# EAGLE design Relaya_the second Version 2 (EAGLE 9.1.2)
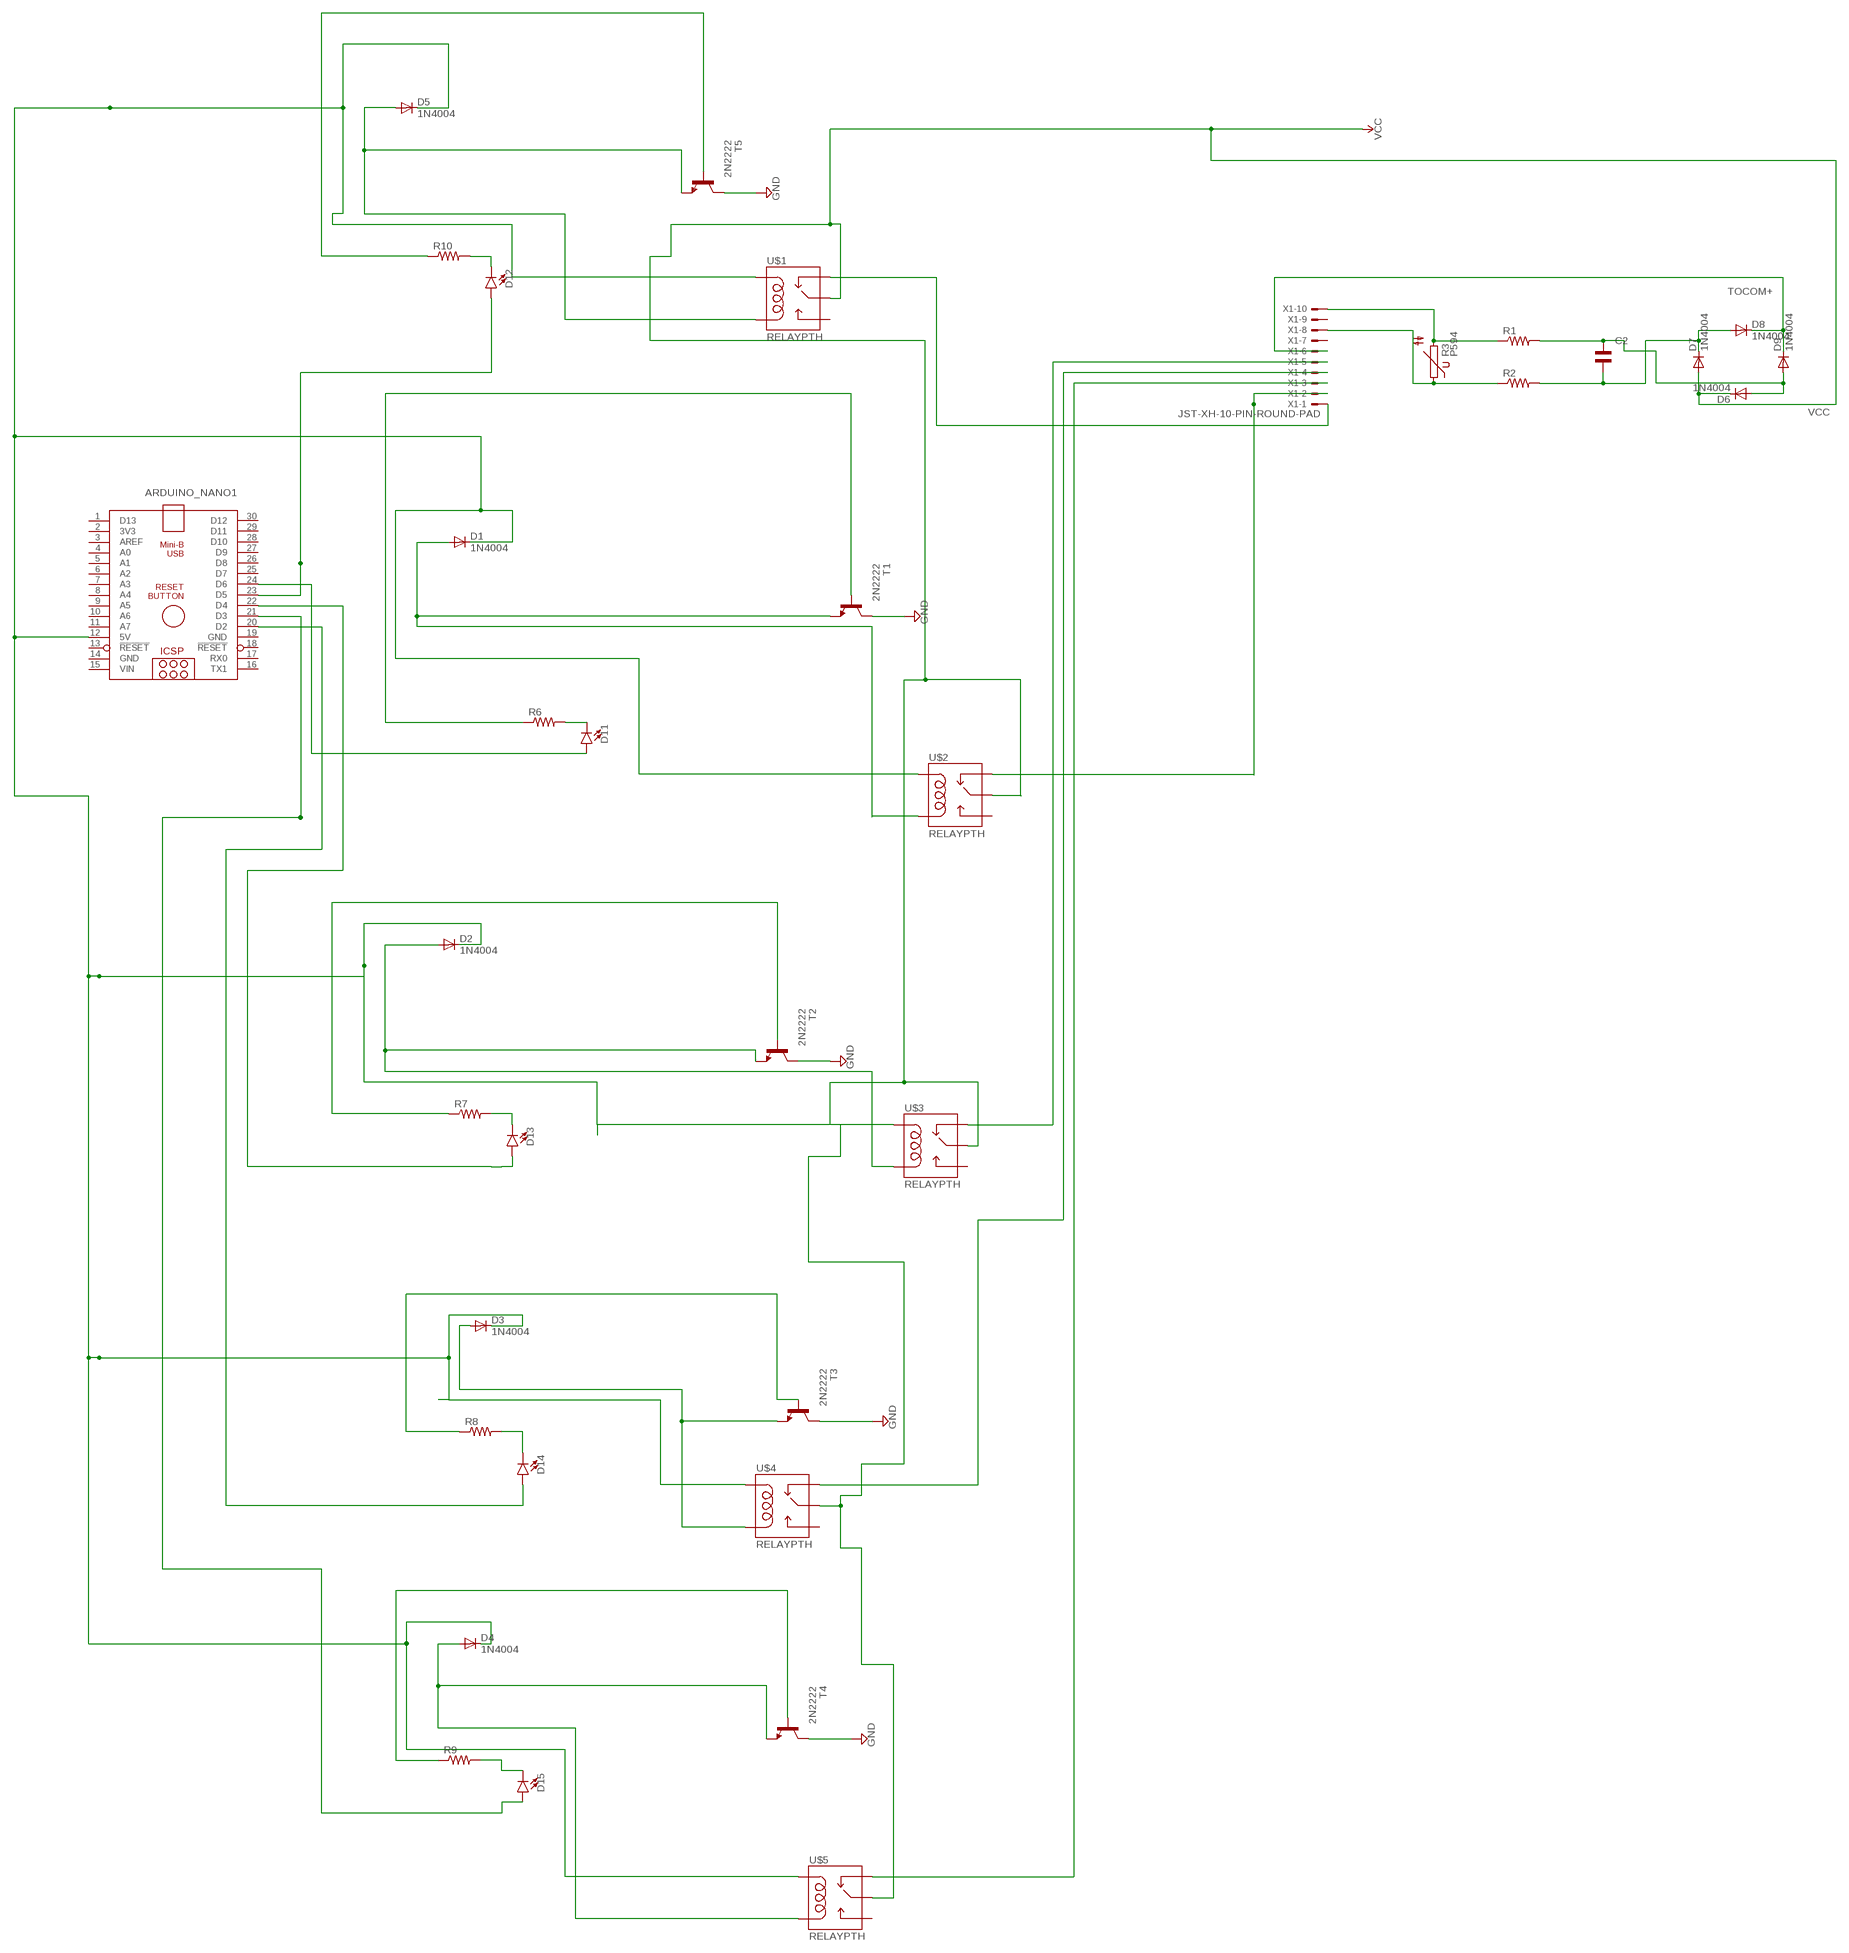
[diagram p0: schematic, sheet 1]

## Parts
ARDUINO_NANO1  ARDUINO_NANO  [ARDUINO_NANO]
C2  WCAP-FTBP_890283323005CS  [WCAP-FTBX,10X13X5.5X4]
D1  1N4004  [DO41-10]
D2  1N4004  [DO41-10]
D3  1N4004  [DO41-10]
D4  1N4004  [DO41-10]
D5  1N4004  [DO41-10]
D6  1N4004  [DO41-10]
D7  1N4004  [DO41-10]
D8  1N4004  [DO41-10]
D9  1N4004  [DO41-10]
D11  LED5MM  [LED_5MM]
D12  LED5MM  [LED_5MM]
D13  LED5MM  [LED_5MM]
D14  LED5MM  [LED_5MM]
D15  LED5MM  [LED_5MM]
R1  R-US_0414/15  [0414/15]
R2  R-US_0414/15  [0414/15]
R3  P594  [P594]
R6  R-US_0207/10  [0207/10]
R7  R-US_0207/10  [0207/10]
R8  R-US_0207/10  [0207/10]
R9  R-US_0207/10  [0207/10]
R10  R-US_0207/10  [0207/10]
T1  2N2222  [TO92-EBC-OVAL]
T2  2N2222  [TO92-EBC-OVAL]
T3  2N2222  [TO92-EBC-OVAL]
T4  2N2222  [TO92-EBC-OVAL]
T5  2N2222  [TO92-EBC-OVAL]
U$1  RELAYPTH  [SRD-05VDC-SL-C]
U$2  RELAYPTH  [SRD-05VDC-SL-C]
U$3  RELAYPTH  [SRD-05VDC-SL-C]
U$4  RELAYPTH  [SRD-05VDC-SL-C]
U$5  RELAYPTH  [SRD-05VDC-SL-C]
X1  JST-XH-10-PIN-ROUND-PAD  [JST-XH-10-PACKAGE-ROUND-PAD]

## Nets
5V [Data]: ARDUINO_NANO1.12(5V) D1.C D2.C D3.C D4.C D5.C U$1.COIL1 U$2.COIL1 U$3.COIL1 U$4.COIL1 U$5.COIL1
GND [Power]: T1.C T2.C T3.C T4.C T5.C
N$1 [Data]: U$1.SWCLOSED(SWCLOSE) X1.1
N$2 [Data]: ARDUINO_NANO1.23(D5) D12.A
N$3 [Data]: R6.1 T1.B
N$4 [Data]: U$2.SWCLOSED(SWCLOSE) X1.2
N$5 [Data]: D1.A T1.E U$2.COIL0
N$6 [Data]: ARDUINO_NANO1.24(D6) D11.A
N$7 [Data]: D2.A T2.E U$3.COIL0
N$8 [Data]: R7.1 T2.B
N$9 [Data]: ARDUINO_NANO1.22(D4) D13.A
N$10 [Data]: U$3.SWCLOSED(SWCLOSE) X1.5
N$11 [Data]: D3.A T3.E U$4.COIL0
N$12 [Data]: R8.1 T3.B
N$13 [Data]: U$4.SWCLOSED(SWCLOSE) X1.4
N$14 [Data]: R10.1 T5.B
N$15: R1.1 R3.2 X1.10
N$16 [Data]: D5.A T5.E U$1.COIL0
N$17 [Data]: R9.1 T4.B
N$18 [Data]: ARDUINO_NANO1.20(D2) D14.A
N$19 [Data]: D4.A T4.E U$5.COIL0
N$20 [Data]: U$5.SWCLOSED(SWCLOSE) X1.3
N$21: R2.1 R3.1 X1.8
N$22 [Data]: ARDUINO_NANO1.21(D3) D15.A
N$23 [Data]: D12.K(C) R10.2
N$24 [Data]: D11.K(C) R6.2
N$25 [Data]: D14.K(C) R8.2
N$26 [Data]: D13.K(C) R7.2
N$27 [Data]: D15.K(C) R9.2
N$29: C2.1 D7.C D8.A R2.2
N$30: C2.2 D6.A D9.A R1.2
TOCOM+ [Power]: D8.C D9.C X1.6
VCC [Power]: D6.C D7.A U$1.SWCOMMON U$2.SWCOMMON U$3.SWCOMMON U$4.SWCOMMON U$5.SWCOMMON
Unconnected: ARDUINO_NANO1.1(D13) ARDUINO_NANO1.2(3V3) ARDUINO_NANO1.3(AREF) ARDUINO_NANO1.4(A0) ARDUINO_NANO1.5(A1) ARDUINO_NANO1.6(A2) ARDUINO_NANO1.7(A3) ARDUINO_NANO1.8(A4) ARDUINO_NANO1.9(A5) ARDUINO_NANO1.10(A6) ARDUINO_NANO1.11(A7) ARDUINO_NANO1.13(!RESET) ARDUINO_NANO1.16(TX1) ARDUINO_NANO1.17(RX0) ARDUINO_NANO1.18(!RESET) ARDUINO_NANO1.25(D7) ARDUINO_NANO1.26(D8) ARDUINO_NANO1.27(D9) ARDUINO_NANO1.28(D10) ARDUINO_NANO1.29(D11) ARDUINO_NANO1.30(D12) U$1.SWOPEN U$2.SWOPEN U$3.SWOPEN U$4.SWOPEN U$5.SWOPEN X1.7 X1.9

## Power pins joined to a net without a drawn wire
GND: ARDUINO_NANO1.14(GND) ARDUINO_NANO1.19(GND)
VIN: ARDUINO_NANO1.15(VIN)

## Library data of the parts
ARDUINO_NANO1 = ArduinoNanoV30 GHIT:ARDUINO_NANO: Arduino Nano V3.0 Overview: The Arduino Nano is a small, complete, and breadboard-friendly board based on the ATmega328 (Arduino Nano 3.x) or ATmega168 (Arduino Nano 2.x). It has more or less the same functionality of the Arduino Duemilanove, but in a different package. It lacks only a DC power jack, and works with a Mini-B USB cable instead of a standard one. The Nano was designed and is being produced by Gravitech. Specifications: Microcontroller Atmel ATmega168 or ATmega328 Operating Voltage (logic level) 5 V Input Voltage (recommended) 7-12 V Input Voltage (limits) 6-20 V Digital I/O Pins 14 (of which 6 provide PWM output) Analog Input Pins 8 DC Current per I/O Pin 40 mA Flash Memory 16 KB (ATmega168) or 32 KB (ATmega328) of which 2 KB used by bootloader SRAM 1 KB (ATmega168) or 2 KB (ATmega328) EEPROM 512 bytes (ATmega168) or 1 KB (ATmega328) Clock Speed 16 MHz Dimensions 0.73" x 1.70" Length 45 mm Width 18 mm Weigth 5 g Power: The Arduino Nano can be powered via the Mini-B USB connection, 6-20V unregulated external power supply (pin 30), or 5V regulated external power supply (pin 27). The power source is automatically selected to the highest voltage source. Memory: The ATmega168 has 16 KB of flash memory for storing code (of which 2 KB is used for the bootloader); the ATmega328 has 32 KB, (also with 2 KB used for the bootloader). The ATmega168 has 1 KB of SRAM and 512 bytes of EEPROM (which can be read and written with the EEPROM library); the ATmega328 has 2 KB of SRAM and 1 KB of EEPROM. Input and Output: Each of the 14 digital pins on the Nano can be used as an input or output, using pinMode(), digitalWrite(), and digitalRead() functions. They operate at 5 volts. Each pin can provide or receive a maximum of 40 mA and has an internal pull-up resistor (disconnected by default) of 20-50 kOhms. In addition, some pins have specialized functions. Visit Arduino - ArduinoBoardNano <https://www.arduino.cc/en/Main/ArduinoBoardNano>
C2 = Wurth_Elektronik_Passive_Capacitors_rev18b:WCAP-FTBP: WCAP-FTBP Film Capacitors Characteristics MKP, Metallized Polypropylene Film Recommended soldering: Wave Operating temperature: -40 °C to +105 °C Climate category: 40/105/56 Self-healing properties Applications Monitor, electrical ballast Power Supplies Other stable demanding applications <http://katalog.we-online.de/media/images/v2/Family_WE_WCAP-FTBP_4mm+Original.jpg> Details see: http://katalog.we-online.de/en/pbs/WCAP-FTBP?m Created by Yingchun,Shan 2017 (C) Wurth Elektronik; WE-NUMBER: 890283323005CS/100nF
D1-D9 = adafruit:1N4004: DIODE General purpose 1N400x type rectifier (With bigger pads) http://www.ladyada.net/library/pcb/eaglelibrary.html
D11-D15 = SparkFun-LED:LED: LED (Generic) Standard schematic elements and footprints for 5mm, 3mm, 1206, and 0603 sized LEDs. Generic LEDs with no color specified.
R1 R2 = rcl:R-US_: RESISTOR, American symbol; SPICEPREFIX: R
R3 = varistor:P594: VARISTOR
R6-R10 = adafruit:R-US_: RESISTOR, American symbol
T1-T5 = adafruit:2N2222: NPN TRANSISTOR Big oval pads
U$1-U$5 = SRD-Relay:RELAY: SPDT relay (COM-00101)
X1 = JST XH Connectors GHII:JST-XH-10-PIN: JST XH Connector 2 Pin Wire to board connector. Pitch: 2,54 mm, (0.100") Number of pins: 10 Created by Rembrandt Electronics www.rembrandtelectronics.com

## Net classes
1 Power: width 0.762 mm, drill 0.762 mm, clearance 0.635 mm
2 Data: width 0.762 mm, drill 0.762 mm, clearance 0.635 mm

## Board
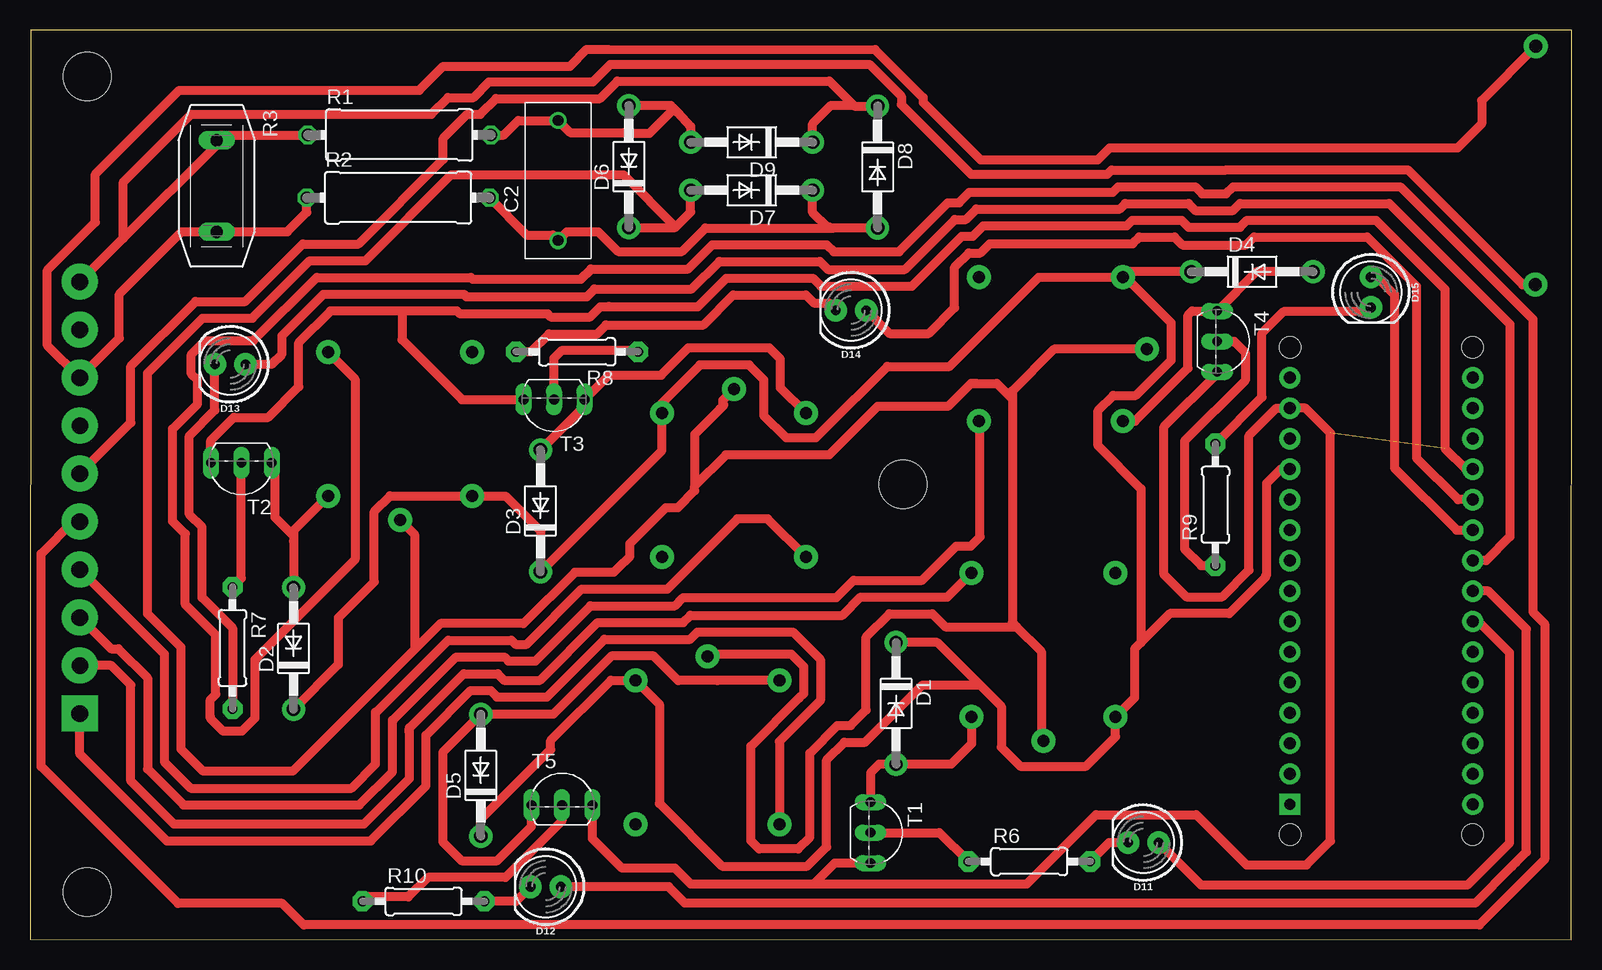
[diagram p1: board, top side]
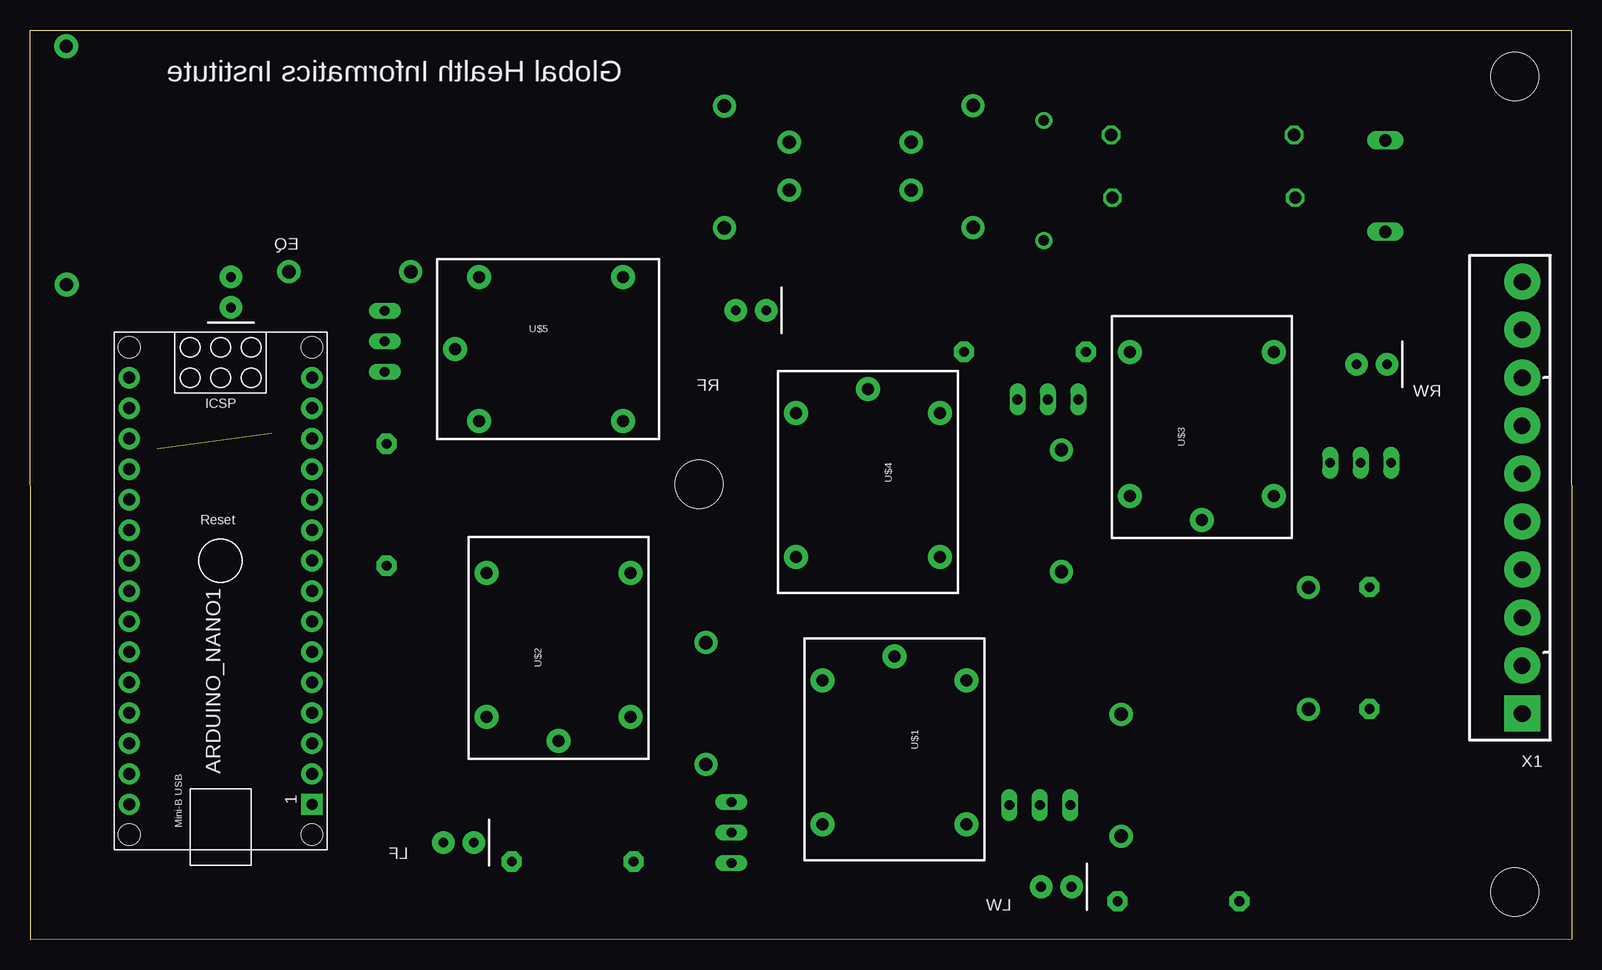
[diagram p2: board, bottom side, seen from below]

Size 128.54 x 75.86 mm. Coordinates in mm from the lower left corner, seen from the top.
Outline: 0,0.04 128.49,0 128.54,75.82 0.05,75.86 0,0.04
Copper layers (1*16): Top 0.035mm / dielectric 1.5mm / Bottom 0.035mm
Design rules "default": minimum track width 6mil, minimum drill 0.35mm, track to track 6mil, track to pad 6mil, pad to pad 6mil, via to via 6mil, smd to smd 6mil, copper to edge 40mil, drill to drill 6mil, minimum pad ring 10mil, minimum via ring 8mil, stop-mask expansion 4mil, vias tented up to drill 0mil, thermal gap 10mil
Holes 4 mm at 72.77,37.98 4.77,71.98 4.77,3.98

### Footprints (pad centres in the part's own frame; a part is rotated, then mirrored left to right if it is on the bottom)
ARDUINO_NANO = drill 0.9 pad 1.778 square: 1 -20.32,-7.62 | drill 1 pad 1.778: 2 -17.78,-7.62; 3 -15.24,-7.62; 4 -12.7,-7.62; 5 -10.16,-7.62; 6 -7.62,-7.62; 7 -5.08,-7.62; 8 -2.54,-7.62; 9 0,-7.62; 10 2.54,-7.62; 11 5.08,-7.62; 12 7.62,-7.62; 13 10.16,-7.62; 14 12.7,-7.62; 15 15.24,-7.62; 16 15.24,7.62; 17 12.7,7.62; 18 10.16,7.62; 19 7.62,7.62; 20 5.08,7.62; 21 2.54,7.62; 22 0,7.62; 23 -2.54,7.62; 24 -5.08,7.62; 25 -7.62,7.62; 26 -10.16,7.62; 27 -12.7,7.62; 28 -15.24,7.62; 29 -17.78,7.62; 30 -20.32,7.62 | hole 1.778: -22.86,-7.62; -22.86,7.62; 17.78,7.62; 17.78,-7.62
WCAP-FTBX,10X13X5.5X4 = drill 0.9 pad 1.4: 1 -5,0; 2 5,0
DO41-10 = drill 1.118 pad 1.93: A 5.08,0; C -5.08,0
LED_5MM = drill 0.813 pad 1.88: A -1.27,0; K 1.27,0
0414/15 = drill 1.016 octagon: 1 -7.62,0; 2 7.62,0
P594 = drill 1.016 long: 1 0,3.81; 2 0,-3.81
0207/10 = drill 0.813 pad 1.676 octagon: 1 -5.08,0; 2 5.08,0
TO92-EBC-OVAL = drill 0.813 long: B 0,-1.27; C 2.54,-1.27; E -2.54,-1.27
SRD-05VDC-SL-C = drill 1 pad 2: COIL0 -5.39,-6.12; COIL1 -5.39,5.88; SWCLOSED 6.61,-6.12; SWCOMMON -7.39,-0.12; SWOPEN 6.61,5.88
JST-XH-10-PACKAGE-ROUND-PAD = drill 1.4 pad 3 square: 1 -18.5,0 | drill 1.4 pad 3: 2 -14.5,0.01; 3 -10.5,0; 4 -6.5,0; 5 -2.5,0; 6 1.5,-0.01; 7 5.5,0.01; 8 9.5,-0.01; 9 13.5,0; 10 17.5,0

### Placement (x,y rotation side)
ARDUINO_NANO1  112.65,31.62 90 bottom
C2  44.03,63.31 90 top
D1  72.19,19.71 270 top
D2  21.97,24.29 90 top
D3  42.56,35.76 90 top
D4  101.88,55.7 0 top
D5  37.58,13.72 90 top
D6  49.92,64.47 90 top
D7  60.16,62.5 180 top
D8  70.65,64.43 270 top
D9  60.16,66.5 180 top
D11  92.81,8.11 180 top
D12  42.99,4.42 180 top
D13  16.68,47.99 180 top
D14  68.44,52.49 180 top
D15  111.78,53.99 270 top
R1  30.79,67.1 0 top
R2  30.69,61.87 0 top
R3  15.56,62.84 180 top
R6  83.3,6.52 0 top
R7  16.88,24.33 270 top
R8  45.6,49.02 180 top
R9  98.82,36.27 90 top
R10  32.8,3.21 0 top
T1  71.34,8.94 270 top
T2  17.61,38.51 180 top
T3  43.68,43.78 180 top
T4  100.24,49.89 270 top
T5  44.35,12.5 0 top
U$1  56.35,16.25 270 bottom
U$2  84.61,23.98 90 bottom
U$3  30.97,42.39 90 bottom
U$4  58.55,38.51 270 bottom
U$5  85.7,49.36 0 bottom
X1  4.15,37.36 90 bottom

### Tracks (layer width: path | path; a pad name or v marks a point on that pad's centre or on a via)
5V
  Top 0.762: D3.C 42.87,30.68 | D3.C 52.67,40.8 U$4.COIL1 52.67,44.74 55.85,47.92 59.95,47.92 61.16,46.7 61.16,43.72 63.02,41.86 65.52,41.86 66.17,42.51 71.47,47.81 76.66,47.81 80.51,51.66 84.09,55.24 U$5.COIL1 | 79.18,21.25 80.97,19.46 80.97,16.04 82.55,14.47 88.03,14.47 90.49,16.93 U$2.COIL1 92.08,20.18 92.08,24.25 92.62,24.79 | 79.18,21.25 75.64,24.79 D1.C | 79.18,21.25 74.4,21.25 69.61,16.46 67.88,16.46 66.4,14.98 66.4,7.75 64.79,6.14 57.7,6.14 52.47,11.37 52.47,19.64 U$1.COIL1 48.43,21.64 43.4,16.61 43.4,15.87 37.58,10.05 D5.C | D2.C 25.7,22.95 25.7,26.84 28.7,29.84 28.7,35.7 30.02,37.02 36.83,37.02 U$3.COIL1 39.63,37 42.56,34.07 D3.C | D4.C 91.55,55.7 U$5.COIL1 | ARDUINO_NANO1.12 104.26,39.24 103.08,38.05 103.08,30.43 103.02,30.37 103.02,30.24 99.97,27.2 95.03,27.2 92.62,24.79 | 92.62,24.79 92.62,37.6 89.03,41.19 89.03,44.12 90.3,45.39 92.18,45.39 95.13,48.33 95.13,51.42 91.31,55.24 U$5.COIL1
GND  (1 unrouted)
  Top 0.762: 65.35,4.65 83.09,4.65 88.86,10.42 97.23,10.42 101.4,6.25 106.4,6.25 108.4,8.25 108.4,42.25 106.33,44.32 ARDUINO_NANO1.14 103.91,44.32 101.62,42.03 101.62,30.82 99.39,28.6 96.38,28.6 94.53,30.45 94.53,42.79 98.97,47.23 T4.C | T2.C 15.08,41.65 16.99,43.56 19.84,43.56 22.4,46.12 22.4,49.78 25.05,52.43 31,52.43 | 65.35,4.65 67.1,6.4 T1.C | 65.35,4.65 55.08,4.65 53.76,5.97 49.36,5.97 46.89,8.44 T5.C | ARDUINO_NANO1.19 119.69,39.24 117.95,40.97 117.95,54.24 112.19,60 101.45,60 100.86,59.41 96.57,59.41 95.99,59.99 91.89,59.99 91.42,59.52 79.47,59.52 78.6,58.65 77.68,58.65 73.51,54.49 68,54.49 67.83,54.49 65.93,54.49 65.26,55.16 58.05,55.16 55.67,52.79 50,52.79 | 31,52.43 35.6,52.43 35.86,52.18 43.15,52.18 43.41,51.92 46.7,51.92 47.56,52.79 50,52.79 | 50,52.79 48.25,52.79 48.24,52.8 | 31,52.43 31,50.04 36,45.04 36.01,45.05 T3.C
N$1
  Top 0.762: X1.1 4.15,15.5 11.4,8.25 28.4,8.25 33,12.85 33,17.05 36.73,20.78 38.4,20.78 38.93,20.25 43.09,20.25 47.89,25.05 55.03,25.05 55.63,25.66 63.59,25.66 65.88,23.36 65.88,19.94 62.47,16.53 U$1.SWCLOSED
N$2
  Top 0.762: 123.53,6.12 124.74,7.33 124.74,25.91 121.57,29.08 ARDUINO_NANO1.23 | 123.53,6.12 123.86,6.45 | D12.A 53.23,4.42 54.6,3.05 120.46,3.05 123.53,6.12
N$3
  Top 0.762: T1.B 75.8,8.94 R6.1
N$4
  Top 0.762: 31.61,17.68 31.61,17.25 | 31.61,17.25 31.61,13.43 27.82,9.65 14.4,9.65 12,9.65 8.4,13.25 8.4,21.25 6.79,22.86 X1.2 | 31.61,17.25 31.61,17.63 36.15,22.18 38.98,22.18 39.51,21.65 42.51,21.65 47.31,26.45 54.45,26.45 55.06,27.05 67.72,27.05 69.24,28.58 76.48,28.58 U$2.SWCLOSED
N$5
  Top 0.762: U$2.COIL0 78.49,16.34 76.78,14.63 D1.A 70.78,14.63 70.07,13.92 T1.E
N$6
  Top 0.762: D11.A 97.63,4.56 119.79,4.56 123.34,8.1 123.34,23.92 120.72,26.54 ARDUINO_NANO1.24
N$7
  Top 0.762: 21.97,33.25 21.97,34.12 U$3.COIL0 | 21.97,33.25 D2.A | T2.E 20.4,39.54 20.4,35.25 21.97,33.68 21.97,33.25
N$8
  Top 0.762: R7.1 17.61,30.14 T2.B
N$9
  Top 0.762: ARDUINO_NANO1.22 121.38,31.62 123.37,33.61 123.37,51.33 113.3,61.4 100.87,61.4 100.28,60.81 97.14,60.81 96.57,61.38 91.31,61.38 90.98,61.06 90.84,60.92 78.89,60.92 78.02,60.05 77.1,60.05 72.93,55.89 66.51,55.89 65.84,56.56 57.47,56.56 55.16,54.25 47.05,54.25 46.43,53.63 36.38,53.63 36.18,53.83 24.48,53.83 21,50.36 21,48.85 20.14,47.99 D13.A
N$10
  Top 0.762: U$3.SWCLOSED 27.1,46.75 27.1,31.7 18.73,23.34 18.73,18.48 17.65,17.39 16.11,17.39 15.03,18.48 15.03,18.62 15.03,20.02 15.48,20.47 15.48,25.42 12.94,27.96 12.94,33.84 11.88,34.9 11.88,42.6 13.97,44.68 13.97,46.67 13.45,47.18 13.45,48.8 14.6,49.95 18.61,49.95 23.9,55.23 36.76,55.23 36.9,55.08 45.91,55.08 46.76,55.93 54.87,55.93 56.89,57.95 66.42,57.95 67,57.37 72.44,57.37 76.52,61.45 77.44,61.45 78.31,62.32 90.26,62.32 90.73,62.78 97.15,62.78 97.72,62.2 99.7,62.2 100.29,62.79 114.22,62.79 125.28,51.73 125.28,27.35 126.27,26.36 126.27,6.7 120.82,1.25 22.83,1.25 21.04,3.04 12.33,3.04 0.92,14.46 0.92,32.17 3.61,34.86 X1.5
N$11
  Top 0.762: U$4.COIL0 62.56,46.01 62.56,48.41 61.61,49.36 54.89,49.36 52.61,47.08 48.25,47.08 T3.E 46.22,44.51 D3.A
N$12
  Top 0.762: T3.B 43.68,48.5 44.31,49.12 50.58,49.12 R8.1
N$13
  Top 0.762: X1.4 11.19,23.82 11.19,14.85 13.4,12.65 26.8,12.65 28.81,14.66 28.81,18.99 28.89,18.99 34.87,24.97 40.14,24.97 40.46,24.65 41.4,24.65 46,29.24 53.13,29.24 58.97,35.09 61.48,35.09 U$4.SWCLOSED
N$14
  Top 0.762: R10.1 28.08,3.56 31.54,3.56 33.17,5.2 39.63,5.2 44.35,9.92 T5.B
N$15  (via drill 1.1 pad 2)
  Top 0.762: R1.1 16.01,67.1 R3.2 15.56,66.27 7.78,58.49 | X1.10 7.78,58.49 | 7.78,58.49 7.78,63.17 13.44,68.83 33.44,68.83 34.84,70.23 36.96,70.23 38.27,71.53 46.94,71.53 48.39,72.99 69.97,72.99 72.63,70.33 72.63,69.64 78.44,63.83 89.8,63.83 90.15,64.18 99.7,64.18 | 99.7,64.18 99.72,64.19 | 99.7,64.18 99.72,64.19 | 99.72,64.19 114.85,64.19 124.42,54.62 v125.49,54.62
N$16
  Top 0.762: 62.44,21.61 U$1.COIL0 57.32,21.64 57.3,21.62 54.03,21.62 51.99,23.66 48.47,23.66 43.61,18.8 D5.A 34.4,15.62 34.4,8.17 35.98,6.59 38.95,6.59 41.81,9.46 T5.E
N$17
  Top 0.762: R9.1 97.64,31.19 96.24,32.59 96.24,41.58 101.31,46.64 101.31,48.96 100.38,49.89 T4.B
N$18
  Top 0.762: ARDUINO_NANO1.20 119.05,36.7 115.57,40.18 115.57,54.49 111.46,58.6 102.03,58.6 101.35,57.92 96.08,57.92 95.41,58.59 92.46,58.59 91.96,58.08 91.91,58.04 80,58.04 79.22,57.26 78.25,57.26 77.07,56.07 77.07,52.7 74.93,50.56 71.64,50.56 D14.A
N$19
  Top 0.762: D4.A 102.23,55.7 T4.E 96.87,52.43 96.52,52.08 96.52,47.66 92.11,43.24 U$5.COIL0
N$20
  Top 0.762: X1.3 6.75,24.26 7.37,24.26 9.8,21.83 9.8,14.25 12.8,11.25 27.45,11.25 30.21,14.01 30.21,18.33 30.28,18.33 35.52,23.57 39.56,23.57 39.88,23.25 42.13,23.25 46.73,27.85 53.76,27.85 54.45,28.54 67.23,28.54 68.66,29.97 74.37,29.97 77.22,32.83 78.44,32.83 79.21,33.6 79.21,43.06 79.09,43.18 U$5.SWCLOSED
N$21  (via drill 1.1 pad 2)
  Top 0.762: R2.1 23.07,60.66 21.44,59.03 R3.1 12.64,59.03 7.44,53.83 7.44,50.16 X1.8 1.44,49.56 1.44,55.83 5.44,59.83 5.44,63.83 12.44,70.83 32.44,70.83 34.44,72.83 45,72.83 46.4,74.23 48,74.23 | 48,74.23 48.21,74.23 70.44,74.23 74.44,70.23 74.44,69.83 79.23,65.04 89,65.04 90,66.04 119,66.04 121,68.04 121,69.97 v125.52,74.49 | 47.79,74.23 48,74.23
N$22
  Top 0.762: ARDUINO_NANO1.21 118.94,34.16 113.75,39.35 113.75,53.8 112.29,55.26 D15.A
N$23
  Top 0.762: R10.2 40.51,3.21 D12.K
N$24
  Top 0.762: D11.K 89.96,8.11 R6.2
N$25
  Top 0.762: R8.2 41.77,49.02 43.26,50.52 47.27,50.52 48.02,51.27 56.13,51.27 58.62,53.76 64.68,53.76 65.35,53.09 66.57,53.09 D14.K 67.09,52.41
N$26
  Top 0.762: R7.2 16.88,26 14.34,28.54 14.34,34.42 13.28,35.48 13.28,42.02 15.41,44.15 D13.K
N$27
  Top 0.762: R9.2 102.71,45.24 102.71,50.57 104.5,52.36 111.42,52.36 D15.K
N$29
  Top 0.762: R2.2 41.41,58.77 43.57,58.77 C2.1 44.76,59.04 47.37,59.04 49.03,57.38 54.34,57.38 56.31,59.35 67,59.35 | D8.A 67,59.35 | 67,59.35 66.57,59.35 66.64,59.42 66.46,59.42 65.24,60.64 D7.C
N$30
  Top 0.762: D6.A 53.41,69.55 53.96,69 | D9.A 55.08,67.8 53.96,69 | 53.64,69.34 53.69,69.29 | 53.69,69.29 53.96,69 | 53.69,69.29 51.64,67.24 49.64,67.24 49.58,67.3 45.04,67.3 C2.2 40.69,68.31 39.48,67.1 R1.2
TOCOM+
  Top 0.762: D9.C 65.24,68.04 66.78,69.58 68.64,69.58 | D8.C 68.71,69.51 68.64,69.58 | 68.64,69.58 66.63,71.59 48.97,71.59 47.52,70.14 38.84,70.14 37.54,68.83 36.44,68.83 34.44,66.83 34.44,65.08 27.39,58.02 22.74,58.02 17.94,53.23 13.8,53.23 8.4,47.83 8.4,43.12 X1.6
VCC
  Top 0.762: U$5.SWCOMMON 85.37,49.24 81.89,45.76 81.89,45.09 | U$2.SWCOMMON 84.3,16.78 84.3,24.04 82.25,26.09 | 82.25,26.09 81.89,26.45 81.89,45.09 | 82.25,26.09 76.31,26.09 75.22,27.18 71.63,27.18 69.69,25.24 69.69,19.15 68.4,17.86 67.3,17.86 65,15.56 65,8.55 64.03,7.58 60.78,7.58 60.1,8.26 60.1,16.13 64.12,20.15 64.49,20.52 64.49,22.78 63.44,23.83 56.66,23.83 U$1.SWCOMMON | 57.84,44.59 57.76,44.51 | 57.76,44.51 57.52,44.27 55.4,42.15 55.4,37.83 | U$3.SWCOMMON 32,33.85 32.05,33.8 32.05,24.2 31.94,24.1 | 31.94,24.1 34.22,26.37 41.15,26.37 45.42,30.64 48.66,30.64 49.03,31.01 50,31.98 50,33.04 53,36.04 54,36.04 55.4,37.44 55.4,37.83 | 31.94,24.1 21.89,14.04 14.44,14.04 12.59,15.89 12.59,24.39 9.8,27.19 9.8,47.25 14.38,51.83 18.52,51.83 23.32,56.62 27.96,56.62 35.12,63.78 49.46,63.78 53.82,59.42 | 78.89,46.39 78.44,46.39 | D6.C 53.79,59.39 53.82,59.42 | D7.A 55.08,60.68 53.82,59.42 | 57.76,44.51 57.76,44.99 U$4.SWCOMMON | 55.4,37.83 58,40.43 66.62,40.43 70.66,44.47 76.52,44.47 78.44,46.39 | 78.44,46.39 80.59,46.39 81.89,45.09

### Text on the board
bNames: Global Health Informatics Institute
_bNames: EQ | RF | RW | LF | LW